# Altium schematic sheet 12-I225_1.SchDoc
size C; SheetNumber: 12; SheetTotal: 13
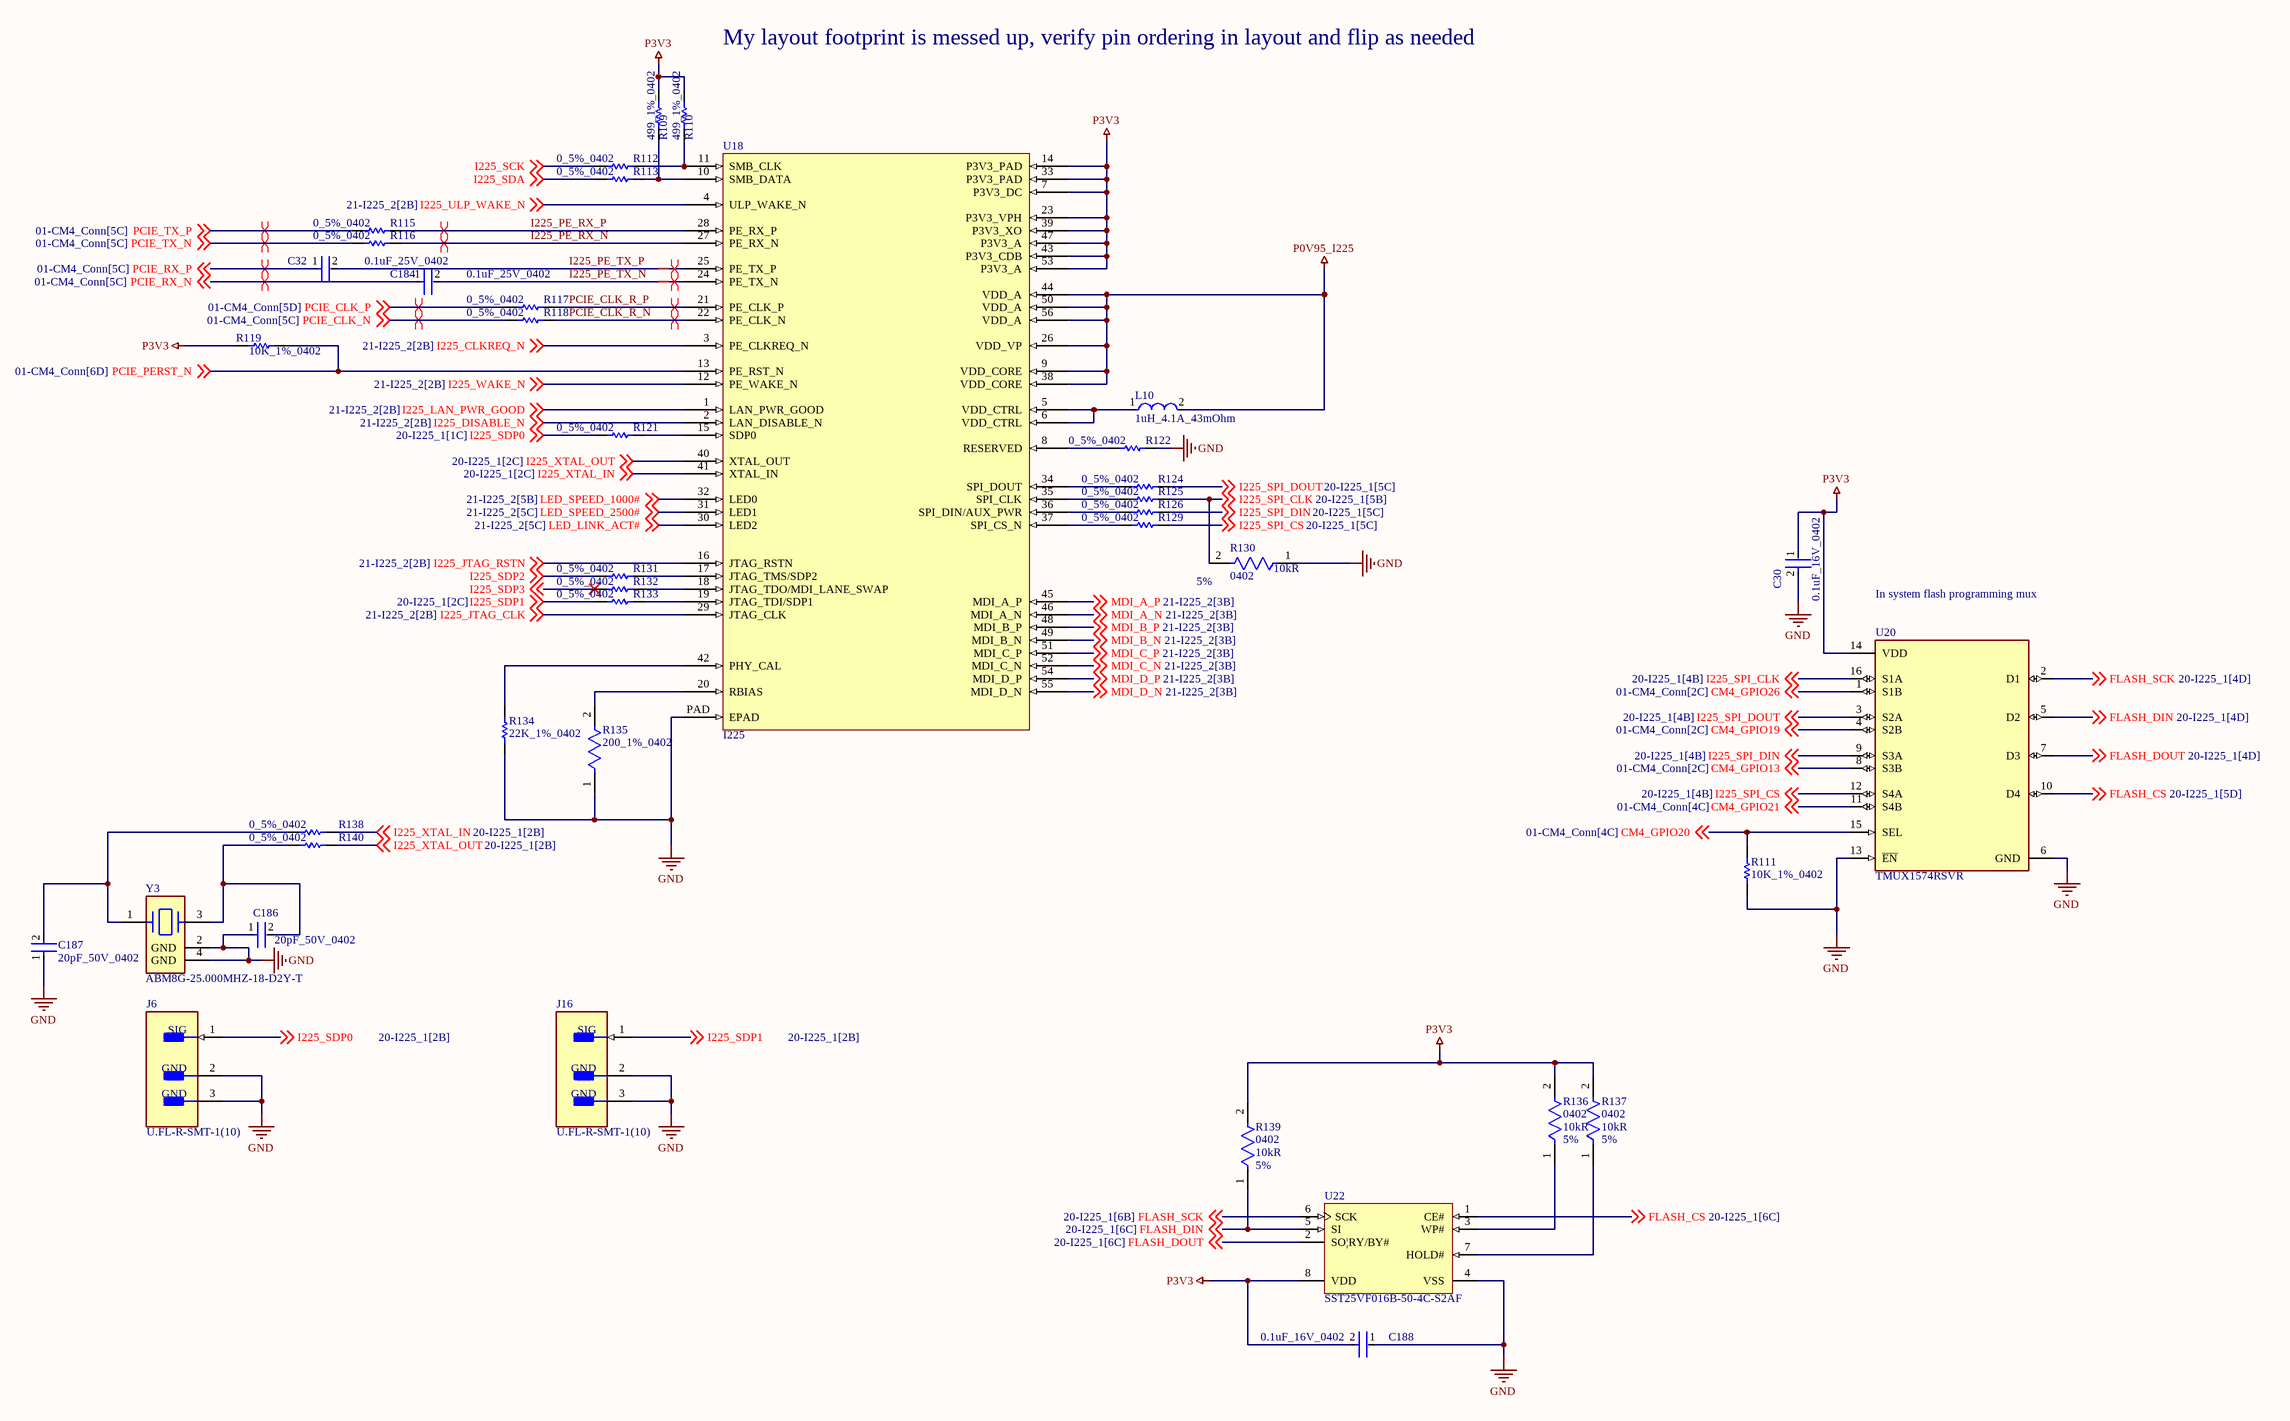
[diagram p0: 12-I225_1.SchDoc]

## Parts
C30  0.1uF_16V_0402  [FP-GRM15-MFG]
C32  0.1uF_25V_0402  [FP-0402-L_1_0_1-W_0_5_0_1-IPC_C]
C184  0.1uF_25V_0402  [FP-0402-L_1_0_1-W_0_5_0_1-IPC_C]
C186  20pF_50V_0402  [FP-C0402-BB-MFG]
C187  20pF_50V_0402  [FP-C0402-BB-MFG]
C188  0.1uF_16V_0402  [FP-GRM15-MFG]
J6  U.FL-R-SMT-1(10)  [FP-U_FL-R-SMT-1_10-MFG]
J16  U.FL-R-SMT-1(10)  [FP-U_FL-R-SMT-1_10-MFG]
L10  1uH_4.1A_43mOhm  [FP-CIGT201610-MFG]
R109  499_1%_0402  [RESC1005X40X25LL05T05]
R110  499_1%_0402  [RESC1005X40X25LL05T05]
R111  10K_1%_0402  [RESC1005X40X25NL10T10]
R112  0_5%_0402  [RESC1005X40X25LL10T10]
R113  0_5%_0402  [RESC1005X40X25LL10T10]
R115  0_5%_0402  [RESC1005X40X25LL10T10]
R116  0_5%_0402  [RESC1005X40X25LL10T10]
R117  0_5%_0402  [RESC1005X40X25LL10T10]
R118  0_5%_0402  [RESC1005X40X25LL10T10]
R119  10K_1%_0402  [RESC1005X40X25NL10T10]
R121  0_5%_0402  [RESC1005X40X25LL10T10]
R122  0_5%_0402  [RESC1005X40X25LL10T10]
R124  0_5%_0402  [RESC1005X40X25LL10T10]
R125  0_5%_0402  [RESC1005X40X25LL10T10]
R126  0_5%_0402  [RESC1005X40X25LL10T10]
R129  0_5%_0402  [RESC1005X40X25LL10T10]
R130  Case/Package: 0402  Resistance: 10kR  Tolerance: 5%  [FP-CRCW0402-e3-IPC_B]  (hidden comment: CRCW040210K0JNED)
R131  0_5%_0402  [RESC1005X40X25LL10T10]
R132  0_5%_0402  [RESC1005X40X25LL10T10]
R133  0_5%_0402  [RESC1005X40X25LL10T10]
R134  22K_1%_0402  [RESC1005X40X25NL05T05]
R135  200_1%_0402  [FP-CRCW0402-e3-IPC_C]
R136  Case/Package: 0402  Resistance: 10kR  Tolerance: 5%  [FP-CRCW0402-e3-IPC_B]  (hidden comment: CRCW040210K0JNED)
R137  Case/Package: 0402  Resistance: 10kR  Tolerance: 5%  [FP-CRCW0402-e3-IPC_B]  (hidden comment: CRCW040210K0JNED)
R138  0_5%_0402  [RESC1005X40X25LL10T10]
R139  Case/Package: 0402  Resistance: 10kR  Tolerance: 5%  [FP-CRCW0402-e3-IPC_B]  (hidden comment: CRCW040210K0JNED)
R140  0_5%_0402  [RESC1005X40X25LL10T10]
U18  I225  [I225 QFN56]
U20  TMUX1574RSVR  [FP-RSV0016A-MFG]
U22  SST25VF016B-50-4C-S2AF  [MCHP-SOIC-S2A8_M]
Y3  ABM8G-25.000MHZ-18-D2Y-T  [FP-ABM8G-MFG]

## Nets
GND: C30.2 C186.1 C187.1 C188.1 J6.2(GND) J6.3(GND) J16.2(GND) J16.3(GND) R111.2 R122.2 R130.1 R134.1 R135.1 U18.PAD(EPAD) U20.6(GND) U20.13(~{EN}) U22.4(VSS) Y3.2(GND) Y3.4(GND)
P0V95_I225: L10.2 U18.9(VDD_CORE) U18.26(VDD_VP) U18.38(VDD_CORE) U18.44(VDD_A) U18.50(VDD_A) U18.56(VDD_A)
P3V3: C30.1 C188.2 R109.2 R110.2 R119.2 R136.2 R137.2 R139.2 U18.7(P3V3_DC) U18.14(P3V3_PAD) U18.23(P3V3_VPH) U18.33(P3V3_PAD) U18.39(P3V3_XO) U18.43(P3V3_CDB) U18.47(P3V3_A) U18.53(P3V3_A) U20.14(VDD) U22.8(VDD)
CM4_GPIO13: U20.8(S3B) ; off-sheet CM4_GPIO13
CM4_GPIO19: U20.4(S2B) ; off-sheet CM4_GPIO19
CM4_GPIO20: R111.1 U20.15(SEL) ; off-sheet CM4_GPIO20
CM4_GPIO21: U20.11(S4B) ; off-sheet CM4_GPIO21
CM4_GPIO26: U20.1(S1B) ; off-sheet CM4_GPIO26
FLASH_CS: U20.10(D4) U22.1(CE#) ; off-sheet FLASH_CS
FLASH_DIN: R139.1 U20.5(D2) U22.5(SI) ; off-sheet FLASH_DIN
FLASH_DOUT: U20.7(D3) U22.2(SO|RY/BY#) ; off-sheet FLASH_DOUT
FLASH_SCK: U20.2(D1) U22.6(SCK) ; off-sheet FLASH_SCK
I225_CLKREQ_N: U18.3(PE_CLKREQ_N) ; off-sheet I225_CLKREQ_N
I225_DISABLE_N: U18.2(LAN_DISABLE_N) ; off-sheet I225_DISABLE_N
I225_JTAG_CLK: U18.29(JTAG_CLK) ; off-sheet I225_JTAG_CLK
I225_JTAG_RSTN: U18.16(JTAG_RSTN) ; off-sheet I225_JTAG_RSTN
I225_LAN_PWR_GOOD: U18.1(LAN_PWR_GOOD) ; off-sheet I225_LAN_PWR_GOOD
I225_PE_RX_N: R116.2 U18.27(PE_RX_N)
I225_PE_RX_P: R115.2 U18.28(PE_RX_P)
I225_PE_TX_N: C184.2 U18.24(PE_TX_N)
I225_PE_TX_P: C32.2 U18.25(PE_TX_P)
I225_SCK: R112.1 ; off-sheet I225_SCK
I225_SDA: R113.1 ; off-sheet I225_SDA
I225_SDP0: J6.1(SIG) R121.1 ; off-sheet I225_SDP0
I225_SDP1: J16.1(SIG) R133.1 ; off-sheet I225_SDP1
I225_SDP2: R131.1 ; off-sheet I225_SDP2
I225_SDP3: R132.1 ; off-sheet I225_SDP3
I225_SPI_CLK: R125.2 R130.2 U20.16(S1A) ; off-sheet I225_SPI_CLK
I225_SPI_CS: R129.2 U20.12(S4A) ; off-sheet I225_SPI_CS
I225_SPI_DIN: R126.2 U20.9(S3A) ; off-sheet I225_SPI_DIN
I225_SPI_DOUT: R124.2 U20.3(S2A) ; off-sheet I225_SPI_DOUT
I225_ULP_WAKE_N: U18.4(ULP_WAKE_N) ; off-sheet I225_ULP_WAKE_N
I225_WAKE_N: U18.12(PE_WAKE_N) ; off-sheet I225_WAKE_N
I225_XTAL_IN: R138.2 U18.41(XTAL_IN) ; off-sheet I225_XTAL_IN
I225_XTAL_OUT: R140.2 U18.40(XTAL_OUT) ; off-sheet I225_XTAL_OUT
LED_LINK_ACT#: U18.30(LED2) ; off-sheet LED_LINK_ACT#
LED_SPEED_1000#: U18.32(LED0) ; off-sheet LED_SPEED_1000#
LED_SPEED_2500#: U18.31(LED1) ; off-sheet LED_SPEED_2500#
MDI_A_N: U18.46(MDI_A_N) ; off-sheet MDI_A_N
MDI_A_P: U18.45(MDI_A_P) ; off-sheet MDI_A_P
MDI_B_N: U18.49(MDI_B_N) ; off-sheet MDI_B_N
MDI_B_P: U18.48(MDI_B_P) ; off-sheet MDI_B_P
MDI_C_N: U18.52(MDI_C_N) ; off-sheet MDI_C_N
MDI_C_P: U18.51(MDI_C_P) ; off-sheet MDI_C_P
MDI_D_N: U18.55(MDI_D_N) ; off-sheet MDI_D_N
MDI_D_P: U18.54(MDI_D_P) ; off-sheet MDI_D_P
PCIE_CLK_N: R118.1 ; off-sheet PCIE_CLK_N
PCIE_CLK_P: R117.1 ; off-sheet PCIE_CLK_P
PCIE_CLK_R_N: R118.2 U18.22(PE_CLK_N)
PCIE_CLK_R_P: R117.2 U18.21(PE_CLK_P)
PCIE_PERST_N: R119.1 U18.13(PE_RST_N) ; off-sheet PCIE_PERST_N
PCIE_RX_N: C184.1 ; off-sheet PCIE_RX_N
PCIE_RX_P: C32.1 ; off-sheet PCIE_RX_P
PCIE_TX_N: R116.1 ; off-sheet PCIE_TX_N
PCIE_TX_P: R115.1 ; off-sheet PCIE_TX_P
NetC186_2: C186.2 R140.1 Y3.3
NetC187_2: C187.2 R138.1 Y3.1
NetL10_1: L10.1 U18.5(VDD_CTRL) U18.6(VDD_CTRL)
NetR109_1: R109.1 R113.2 U18.10(SMB_DATA)
NetR110_1: R110.1 R112.2 U18.11(SMB_CLK)
NetR121_2: R121.2 U18.15(SDP0)
NetR122_1: R122.1 U18.8(RESERVED)
NetR124_1: R124.1 U18.34(SPI_DOUT)
NetR125_1: R125.1 U18.35(SPI_CLK)
NetR126_1: R126.1 U18.36(SPI_DIN/AUX_PWR)
NetR129_1: R129.1 U18.37(SPI_CS_N)
NetR131_2: R131.2 U18.17(JTAG_TMS/SDP2)
NetR132_2: R132.2 U18.18(JTAG_TDO/MDI_LANE_SWAP)
NetR133_2: R133.2 U18.19(JTAG_TDI/SDP1)
NetR134_2: R134.2 U18.42(PHY_CAL)
NetR135_2: R135.2 U18.20(RBIAS)
NetR136_1: R136.1 U22.3(WP#)
NetR137_1: R137.1 U22.7(HOLD#)

## Layout directives
differential pair: I225_PE_RX_N, I225_PE_RX_P, I225_PE_TX_N, I225_PE_TX_P, PCIE_CLK_N, PCIE_CLK_P, PCIE_CLK_R_N, PCIE_CLK_R_P, PCIE_RX_N, PCIE_RX_P, PCIE_TX_N, PCIE_TX_P

## Notes on the sheet
- My layout footprint is messed up, verify pin ordering in layout and flip as needed
- In system flash programming mux

## Library data of the parts
C30 C188 = CMP-2100-03641-2: CAP CER 0.1UF 16V X7R 0402; Manufacturer Part Number: GRM155R71C104KA88D; Manufacturer: Murata; Standoff Height: 0mm; Tolerance: 10%; Voltage Rating: 16Vdc; Material: Ceramic; Capacitance: 0.10μF; Value: 0.10μF; RoHS: TRUE; Temperature Characteristic: X7R; Octopart: https://octopart.com/grm155r71c104ka88d-murata-196880; Digikey Description: CAP CER 0.1UF 16V X7R 0402; Device Class L3: Ceramic Capacitors; Height: 0.55mm; ComponentLink2Description: Datasheet; Temperature Range Low: -55°C; Ipc Land Pattern Name: CAPC10050X219; ComponentLink2URL: https://search.murata.co.jp/Ceramy/image/img/A01X/G101/ENG/GRM155R71H471KA01-01A.pdf; Device Class L1: Passive Components; Lead Free: yes; Category: Cap; Package: GRM15; Temperature: -55°C to +125°C; Device Class L2: Capacitors; Temperature Range High: +125°C; Mouser Description: 0402 0.1 uF 16V ±10 % Tolerance X7R SMT Multilayer Ceramic Capacitor
C32 C184 = CMP-2008-02519-2: General Purpose Ceramic Capacitor, 0402, 100nF, 10%, X7R, 15%, 25V; Package Quantity: 1; Capacitance: 100nF; Min Operating Temperature: -55°C; Voltage: 25V; Voltage Rating: 25V; Construction: Flat; Max Operating Temperature: 125°C; Radiation Hardening: No; Depth: 0.5mm; Thickness: 0.022inch; Voltage Rating (DC): 25V; Number of Pins: 2; Lead Free: Lead Free; Series: -; REACH SVHC: No SVHC; Length: 1mm; Dielectric: X7R; RoHS Compliant: Yes; Mount: Surface Mount; Packaging: Tape and Reel; Case/Package: 0402; Case Code (Imperial): 0402; Termination: SMD/SMT; Width: 0.02inch; Case Code (Metric): 1005; Tolerance: 10%
C186 C187 = CMP-1034-00890-3: CAP CER 20PF 50V 5% NP0 0402; Manufacturer Part Number: C0402C200J5GACTU; Manufacturer: Kemet; Tolerance: 0.05; Material: Ceramic; Temperature Characteristic: C0G; Temperature Coefficient: 15%; Octopart: https://octopart.com/c0402c200j5gactu-kemet-9143900; ComponentLink2Description: Datasheet; RoHS: TRUE; Ipc Land Pattern Name: CAPC10050X50; Temperature: -55°C to +125°C; Lead Free: Yes; Mouser Description: Multilayer Ceramic Capacitors MLCC - SMD/SMT 50volts 20pF C0G 5%; Device Class L1: Passive Components; Category: Cap; Package: C0402-BB; Temperature Range High: +125°C; Voltage Rating: 50 V; Temperature Range Low: -55°C; Device Class L2: Capacitors; Device Class L3: Ceramic Capacitors; Height: 0.55mm; Capacitance: 20 pF; Value: 20 pF; ComponentLink2URL: https://content.kemet.com/datasheets/KEM_C1002_X7R_SMD.pdf; Digikey Description: CAP CER 20PF 50V 5% NP0 0402; Automotive: No
J6 J16 = CMP-2000-05152-3: CONN U.FL RCPT STR 50 OHM SMD; Max Frequency: 6GHz; Connector Type: Coaxial; Body Plating: Silver; Body Material: Bronze; Impedance: 50R; Dielectric Material: Polymer; Insulation Resistance: 500MR; Gender: Male; Packaging: Cut Tape; Length: 3mm; Package Quantity: 2500; Termination: Solder; Lead Free: Lead Free; Series: U.FL; Min Operating Temperature: -40°C; Fastening Type: Snap; Contact Material: Brass; Orientation: Straight; Wire/Cable Type: Coaxial; Frequency: 6GHz; Contact Plating: Gold; Depth: 3.1mm; Weight: 0.001764oz; Max Operating Temperature: 90°C; Radiation Hardening: No; REACH SVHC: No SVHC; Mount: Surface Mount; Housing Color: Beige
L10 = CMP-13278-000005-1: FIXED IND 1UH 4.1A 43 MOHM SMD; DC Resistance (DCR): 43mR; Shielding: Unshielded; Saturation Current: 4.5A; Tolerance: 20%; Core Material: Metal; Test Frequency: 1MHz; Resistor Type: Thin Film; Case Code (Imperial): 0806; Case Code (Metric): 2016; RoHS Compliant: Yes; Min Operating Temperature: -40°C; Mount: Surface Mount; Max Operating Temperature: 125°C; Packaging: Cut Tape; Current Rating: 4.1A; Case/Package: 0806; Inductance: 1uH
R109 R110 = CMP-2002-00965-1: Manufacturer: Panasonic; Part Number: ERJ-2RKF4990X
R111 R119 = CMP-2002-04694-1: Manufacturer: Bourns; Part Number: CR0402-FX-1002GLF
R112 R113 R115-R118 R121 R122 R124-R126 R129 R131-R133 R138 R140 = CMP-2002-04569-1: Manufacturer: KOA Speer; Part Number: RK73Z1ETTP
R130 R136 R137 R139 = CMP-2002-08136-3: RES Thick Film, 10kΩ, 5%, 0.063W, 200ppm/°C, 0402; Voltage Rating: 50V; Power Rating: 63mW; Military Standard: Not; Packaging: Tape and Reel; Case Code (Imperial): 0402; Min Operating Temperature: -55°C; Case Code (Metric): 1005; Temperature Coefficient: 200ppm/°C; Termination: SMD/SMT; Composition: Thick Film; Depth: 0.5mm; Number of Terminations: 2; Contact Plating: Tin; Height: 0.016inch; Width: 0.5mm; Max Operating Temperature: 155°C; Features: Automotive AEC-Q200; Length: 1mm; Radiation Hardening: No; Max Power Dissipation: 63mW; Mount: Surface Mount; Package Quantity: 1; Weight: 2.3E-05oz
R134 = CMP-1011-00659-2: Part Number: CRCW040222K0FKED; Manufacturer: Vishay Dale
R135 = CMP-1011-00429-3: RES Thick Film, 200Ω, 1%, 0.063W, 100ppm/°C, 0402; Max Power Dissipation: 63mW; Voltage Rating: 50V; Resistance: 200R; Termination: SMD/SMT; Weight: 2.3E-05oz; Case/Package: 0402; Contact Plating: Tin; Number of Pins: 2; Width: 0.5mm; Height: 0.35mm; Case Code (Metric): 1005; Military Standard: Not; Features: Automotive AEC-Q200; Power Rating: 63mW; Temperature Coefficient: 100ppm/°C; Tolerance: 1%; Lead Free: Lead Free; Depth: 0.5mm; Max Operating Temperature: 155°C; Min Operating Temperature: -55°C; Package Quantity: 10; Voltage Rating (DC): 50V; Composition: Thick Film; Mount: Surface Mount; Radiation Hardening: No; Length: 1mm; Packaging: Tape and Reel; Number of Terminations: 2; Case Code (Imperial): 0402
U20 = CMP-04892-000064-2: IC SWITCH SPDT QUAD 16UQFN; RoHS Compliant: Yes
U22 = CMP-0378-00041-1: 16 Mbit SPI Serial Flash, 2.7 to 3.6 V, 50 MHz, 0 to 70 degC, 8-pin SOIC (S2A8), Tube; Manufacturer: Microchip; PackageReference: SOIC-S2A8; PackageVersion: Rev. A; ComponentLink3URL: http://ww1.microchip.com/downloads/en/DeviceDoc/25051A.pdf; ComponentLink1Description: Manufacturer URL; ComponentLink4URL: http://www.microchip.com/SST25VF016B; ComponentLink1URL: http://www.microchip.com; DatasheetVersion: Rev. A; ComponentLink2URL: http://ww1.microchip.com/downloads/en/DeviceDoc/25044A.pdf; PackageDescription: 8-Lead Plastic Small Outline Intergrated Circuit, 5.275 x 5.275 mm Body, 1.27 mm Pitch; PartNumber: SST25VF016B-50-4C-S2AF; ComponentLink3Description: Package Specification; ComponentLink2Description: Datasheet; Mounting Technology: Surface Mount; ComponentLink4Description: Product URL
Y3 = CMP-2000-05733-2: CRYSTAL 25.0000MHZ 18PF SMD; Manufacturer: Abracon; Stability: 30ppm; Frequency: 25MHz; Esr: 60Ω; Tolerance: 20ppm; Automotive: No; Series: ABM8G; Temperature Range High: +85°C; ComponentLink2URL: https://abracon.com/Resonators/ABM8G.pdf; RoHS: TRUE; Octopart: https://octopart.com/abm8g-25.000mhz-18-d2y-t-abracon-12676602; Package: ABM8G; Category: Crys; Device Class L2: Crystals / Oscillators; ComponentLink2Description: Datasheet; Manufacturer Part Number: ABM8G-25.000MHZ-18-D2Y-T; Height: 1mm; Lead Free: Yes; Digikey Description: CRYSTAL 25.0000MHZ 18PF SMD; Temperature Range Low: -40°C; Device Class L3: Crystals; Load Capacitance: 18pF; Temperature: -40°C to +85°C; Device Class L1: Passive Components; Mouser Description: Crystals 25.000MHz 18pF 30ppm -40C +85C